# Altium schematic sheet IMU_Board_IMU_CG.SchDoc: Inertial Measurement Unit & GPS
size B; Author: Christian; Organization: Husky Robotics; Address1: University of Washington; Address2: Mechanical Engineering; Address3: Seattle, WA; Address4: Australia 2086; Revision: A; SheetNumber: 2; SheetTotal: 2
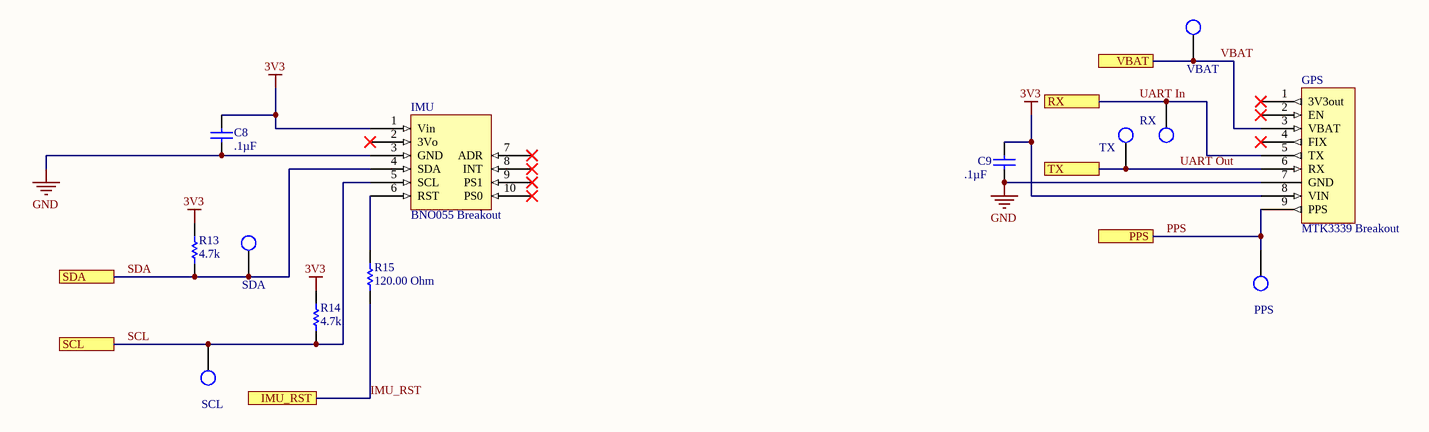
[diagram p0: IMU_Board_IMU_CG.SchDoc]

## Parts
C8  Capacitance: .1µF  [Cap 0805]  (hidden comment: Capacitor 0805)
C9  Capacitance: .1µF  [Cap 0805]  (hidden comment: Capacitor 0805)
GPS  MTK3339 Breakout  [MTK3339 Breakout]
IMU  BNO055 Breakout  [BNO055 Breakout]
PPS  Test Point  [Test Point Through-hole]  (value not drawn)
R13  value 4.7k  [RESC0805(2012)_N]  (hidden comment: 120R)
R14  value 4.7k  [RESC0805(2012)_N]  (hidden comment: 120R)
R15  value 120.00 Ohm  [RESC0805(2012)_N]  (hidden comment: 120R)
RX  Test Point  [Test Point Through-hole]  (value not drawn)
SCL  Test Point  [Test Point Through-hole]  (value not drawn)
SDA  Test Point  [Test Point Through-hole]  (value not drawn)
TX  Test Point  [Test Point Through-hole]  (value not drawn)
VBAT  Test Point  [Test Point Through-hole]  (value not drawn)

## Ports
IMU_RST, PPS, RX, SCL, SDA, TX, VBAT

## Nets
3V3: C8.2 C9.2 GPS.8(VIN) IMU.1(Vin) R13.2 R14.2
GND: C8.1 C9.1 GPS.7(GND) IMU.3(GND)
IMU_RST: R15.1 ; port IMU_RST
PPS: GPS.9(PPS) PPS.1 ; port PPS
SCL: IMU.5(SCL) R14.1 SCL.1 ; port SCL
SDA: IMU.4(SDA) R13.1 SDA.1 ; port SDA
UART In: GPS.5(TX) RX.1 ; port RX
UART Out: GPS.6(RX) TX.1 ; port TX
VBAT: GPS.3(VBAT) VBAT.1 ; port VBAT
NetIMU_6: IMU.6(RST) R15.2

Not connected (* = marked no-connect by the designer): GPS 1(3V3out)* 2(EN)* 4(FIX)*; IMU 2(3Vo)* 7(ADR)* 8(INT)* 9(PS1)* 10(PS0)*

## Notes on the sheet
- Title
- Size:
- Date:
- B
- Author:
- Revision:
- Sheet
- of
- File:

## Library data of the parts
C8 C9 = Capacitor 0805: Standard Capacitor; Manufacturer: AVX; Tolerance (%): ±10%; Dielectric: X5R; Rated Voltage: 10V; Datasheet Version: 05/2016; Manufacturer URL: http://www.avx.com/; Package Description: 2-Pin Surface Mount Device, Body 2.01 x 1.25 mm; Mounting Technology: SurfaceMount; Case Size/Dimension: 0805; Package Reference: 0805; Datasheet URL: http://datasheets.avx.com/cx5r.pdf
R13-R15 = Resistor 0805: Generic 0805 Resistor; Tolerance: 5 %; Case-Metric: 2012; Case-EIA: 0805; Power: 0.125 W; Technology: SMT